# EAGLE schematic i2c_stm32 (EAGLE 9.6.2)

## Sheet 1 of 3: STM32F103C8 - Microcontroller
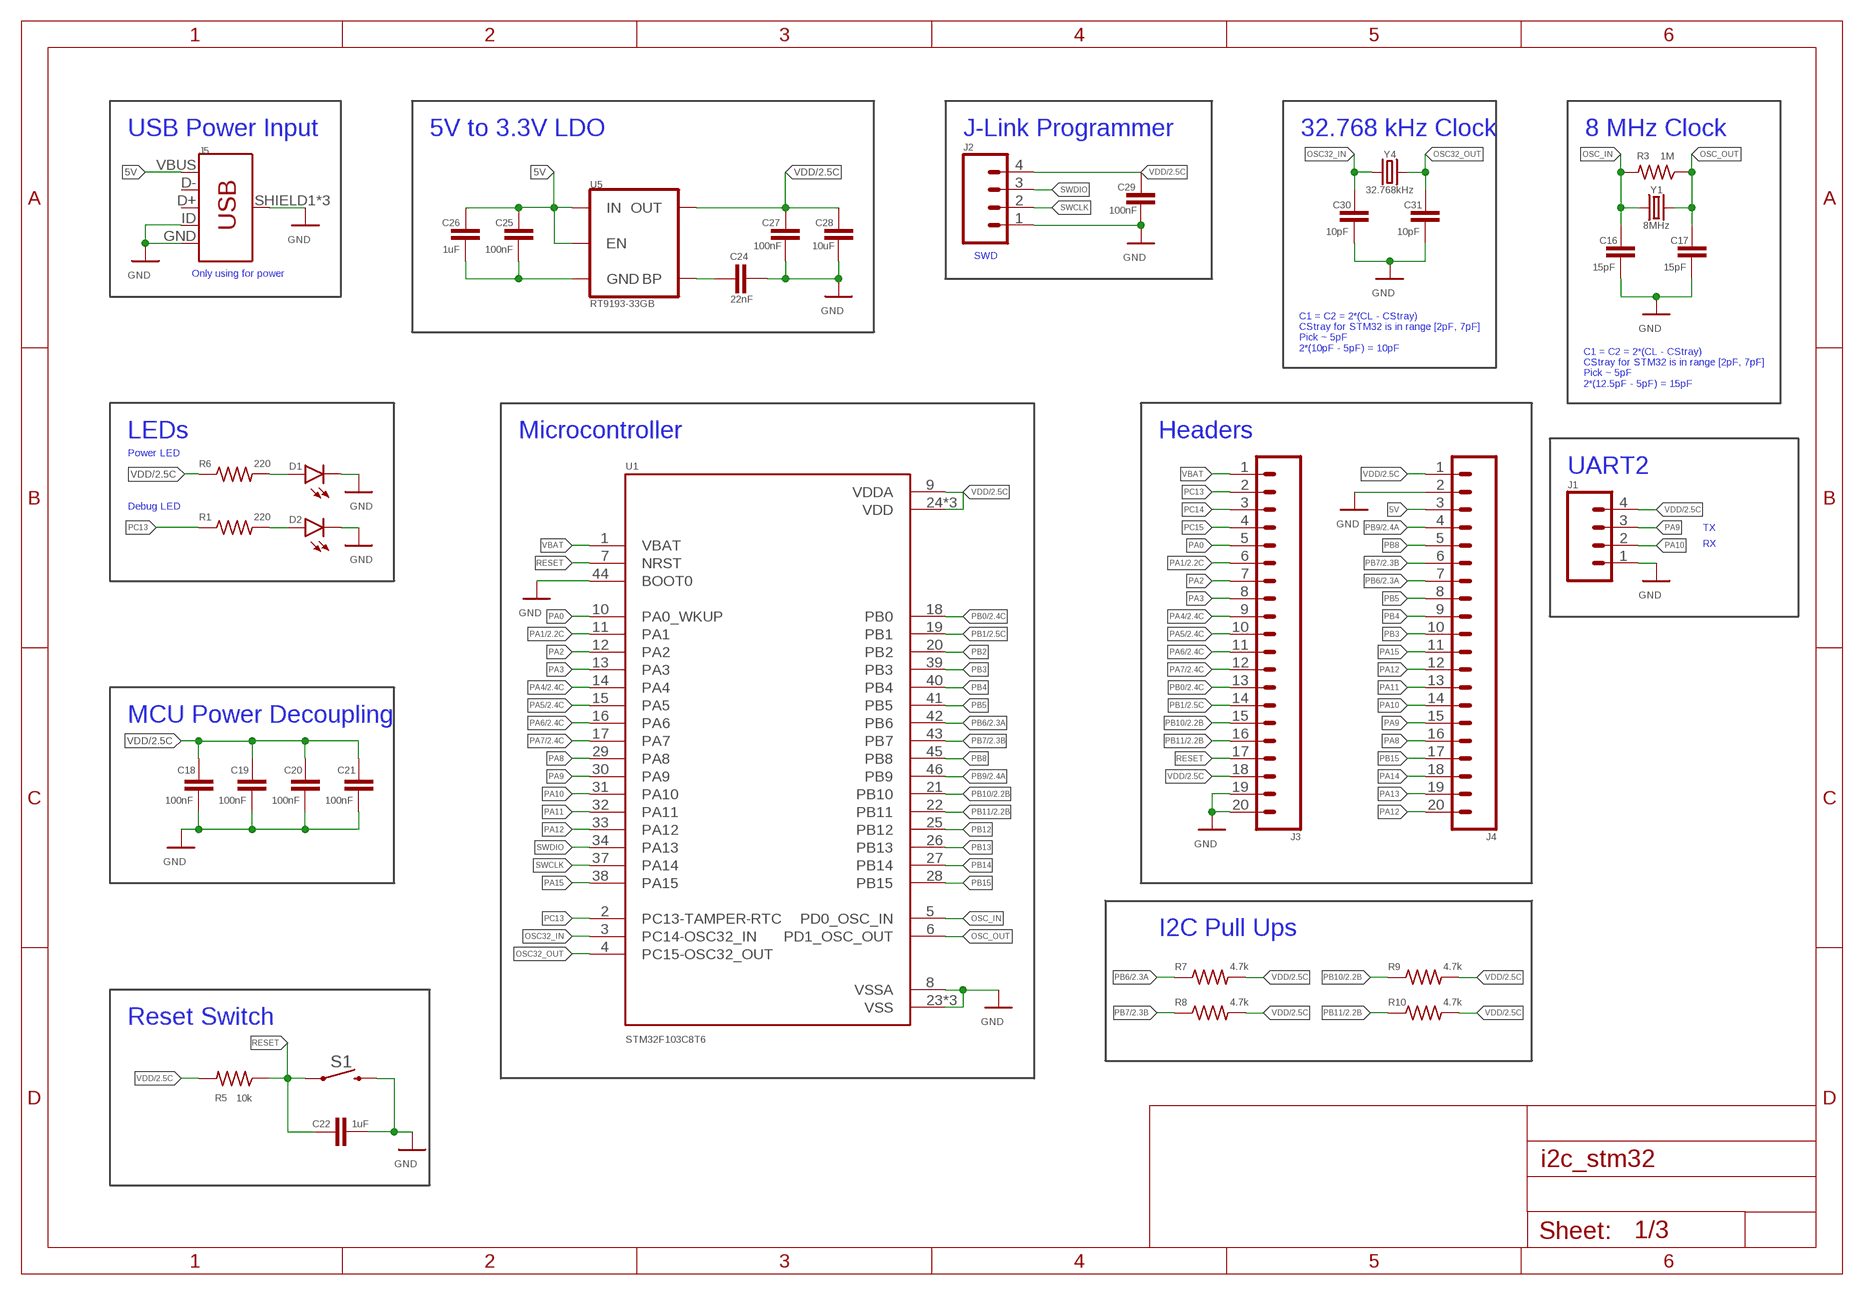
[diagram p0: schematic, sheet 1]

### Parts
C16  15pF  C0603C100C5GACTU  [CAP_0603]
C17  15pF  C0603C100C5GACTU  [CAP_0603]
C18  100nF  C0603C100C5GACTU  [CAP_0603]
C19  100nF  C0603C100C5GACTU  [CAP_0603]
C20  100nF  C0603C100C5GACTU  [CAP_0603]
C21  100nF  C0603C100C5GACTU  [CAP_0603]
C22  1uF  C0603C100C5GACTU  [CAP_0603]
C24  22nF  C0603C100C5GACTU  [CAP_0603]
C25  100nF  C0603C100C5GACTU  [CAP_0603]
C26  1uF  C0603C100C5GACTU  [CAP_0603]
C27  100nF  C0603C100C5GACTU  [CAP_0603]
C28  10uF  C0603C100C5GACTU  [CAP_0603]
C29  100nF  C0603C100C5GACTU  [CAP_0603]
C30  10pF  C0603C100C5GACTU  [CAP_0603]
C31  10pF  C0603C100C5GACTU  [CAP_0603]
D1  LED0603  [LED-0603]
D2  LED0603  [LED-0603]
J1  CONN_04  [1X04]
J2  CONN_04  [1X04]
J3  CONN_20  [1X20]
J4  CONN_20  [1X20]
J5  USB_MICRO-B_FEMALE-SMT  [USB-B-MICRO-SMD]
R1  220  RC0603JR-070RL  [RES_0603]
R3  1M  RC0603JR-070RL  [RES_0603]
R5  10k  RC0603JR-070RL  [RES_0603]
R6  220  RC0603JR-070RL  [RES_0603]
R7  4.7k  RC0603JR-070RL  [RES_0603]
R8  4.7k  RC0603JR-070RL  [RES_0603]
R9  4.7k  RC0603JR-070RL  [RES_0603]
R10  4.7k  RC0603JR-070RL  [RES_0603]
S1  MOMENTARY-SWITCH-SPST-PTH-6.0MM  [TACTILE_SWITCH_PTH_6.0MM]
U1  STM32F103C8T6  [QFP50P900X900X160-48N]
U5  RT9193-33GB  V_REG_MIC5205ADJ  [SOT23-5]
Y1  8MHz  CRYSTAL-8MHZSMD-5X3.2  [CRYSTAL-SMD-5X3.2-4PAD]
Y4  32.768kHz  CRYSTAL-32.768KHZSMD-3.2X1.5  [CRYSTAL-SMD-3.2X1.5MM]

### Nets
5V: C25.2 C26.2 J4.3 J5.VBUS U5.1(IN) U5.3(EN)
GND: C16.2 C17.2 C18.2 C19.2 C20.2 C21.2 C22.2 C24.1 C27.2 C28.2 C29.2 C30.2 C31.2 D1.C D2.C J1.1 J2.1 J3.19 J3.20 J4.2 J5.GND J5.ID J5.SHIELD1(SHIELD) J5.SHIELD2(SHIELD) J5.SHIELD3(SHIELD) S1.3 U1.8(VSSA) U1.23(VSS) U1.35(VSS) U1.44(BOOT0) U1.47(VSS) ; also sheet 2
N$4: D1.A R6.2
N$5: C24.2 U5.4(BP)
N$6: D2.A R1.2
N$14: C25.1 C26.1 U5.2(GND)
OSC32_IN: C30.1 U1.3(PC14-OSC32_IN) Y4.P$1
OSC32_OUT: C31.1 U1.4(PC15-OSC32_OUT) Y4.P$2
OSC_IN: C16.1 R3.2 U1.5(PD0_OSC_IN) Y1.1
OSC_OUT: C17.1 R3.1 U1.6(PD1_OSC_OUT) Y1.3
PA0: J3.5 U1.10(PA0_WKUP)
PA1: J3.6 U1.11(PA1) ; also sheet 2
PA2: J3.7 U1.12(PA2)
PA3: J3.8 U1.13(PA3)
PA4: J3.9 U1.14(PA4) ; also sheet 2
PA5: J3.10 U1.15(PA5) ; also sheet 2
PA6: J3.11 U1.16(PA6) ; also sheet 2
PA7: J3.12 U1.17(PA7) ; also sheet 2
PA8: J4.16 U1.29(PA8)
PA9: J1.3 J4.15 U1.30(PA9)
PA10: J1.2 J4.14 U1.31(PA10)
PA11: J4.13 U1.32(PA11)
PA12: J4.12 J4.20 U1.33(PA12)
PA13: J4.19
PA14: J4.18
PA15: J4.11 U1.38(PA15)
PB0: J3.13 U1.18(PB0) ; also sheet 2
PB1: J3.14 U1.19(PB1) ; also sheet 2
PB2: U1.20(PB2)
PB3: J4.10 U1.39(PB3)
PB4: J4.9 U1.40(PB4)
PB5: J4.8 U1.41(PB5)
PB6: J4.7 R7.1 U1.42(PB6) ; also sheet 2
PB7: J4.6 R8.1 U1.43(PB7) ; also sheet 2
PB8: J4.5 U1.45(PB8)
PB9: J4.4 U1.46(PB9) ; also sheet 2
PB10: J3.15 R9.1 U1.21(PB10) ; also sheet 2
PB11: J3.16 R10.1 U1.22(PB11) ; also sheet 2
PB12: U1.25(PB12)
PB13: U1.26(PB13)
PB14: U1.27(PB14)
PB15: J4.17 U1.28(PB15)
PC13: J3.2 R1.1 U1.2(PC13-TAMPER-RTC)
PC14: J3.3
PC15: J3.4
RESET: C22.1 J3.17 R5.1 S1.1 U1.7(NRST)
SWCLK: J2.2 U1.37(PA14)
SWDIO: J2.3 U1.34(PA13)
VBAT: J3.1 U1.1(VBAT)
VDD: C18.1 C19.1 C20.1 C21.1 C27.1 C28.1 C29.1 J1.4 J2.4 J3.18 J4.1 R5.2 R6.1 R7.2 R8.2 R9.2 R10.2 U1.9(VDDA) U1.24(VDD) U1.36(VDD) U1.48(VDD) U5.5(OUT) ; also sheet 2
Unconnected: J5.D+ J5.D-

### Notes on the sheet
- USB Power Input | 5V to 3.3V LDO | J-Link Programmer | 32.768 kHz Clock | 8 MHz Clock
- SWD
- Only using for power
- C1 = C2 = 2*(CL - CStray)
  CStray for STM32 is in range [2pF, 7pF]
  Pick ~ 5pF
  2*(10pF - 5pF) = 10pF
- C1 = C2 = 2*(CL - CStray)
  CStray for STM32 is in range [2pF, 7pF]
  Pick ~ 5pF
  2*(12.5pF - 5pF) = 15pF
- LEDs | Microcontroller | Headers
- Power LED
- UART2
- Debug LED
- TX
- RX
- MCU Power Decoupling
- I2C Pull Ups
- Reset Switch

## Sheet 2 of 3: BMP280 - Barometer
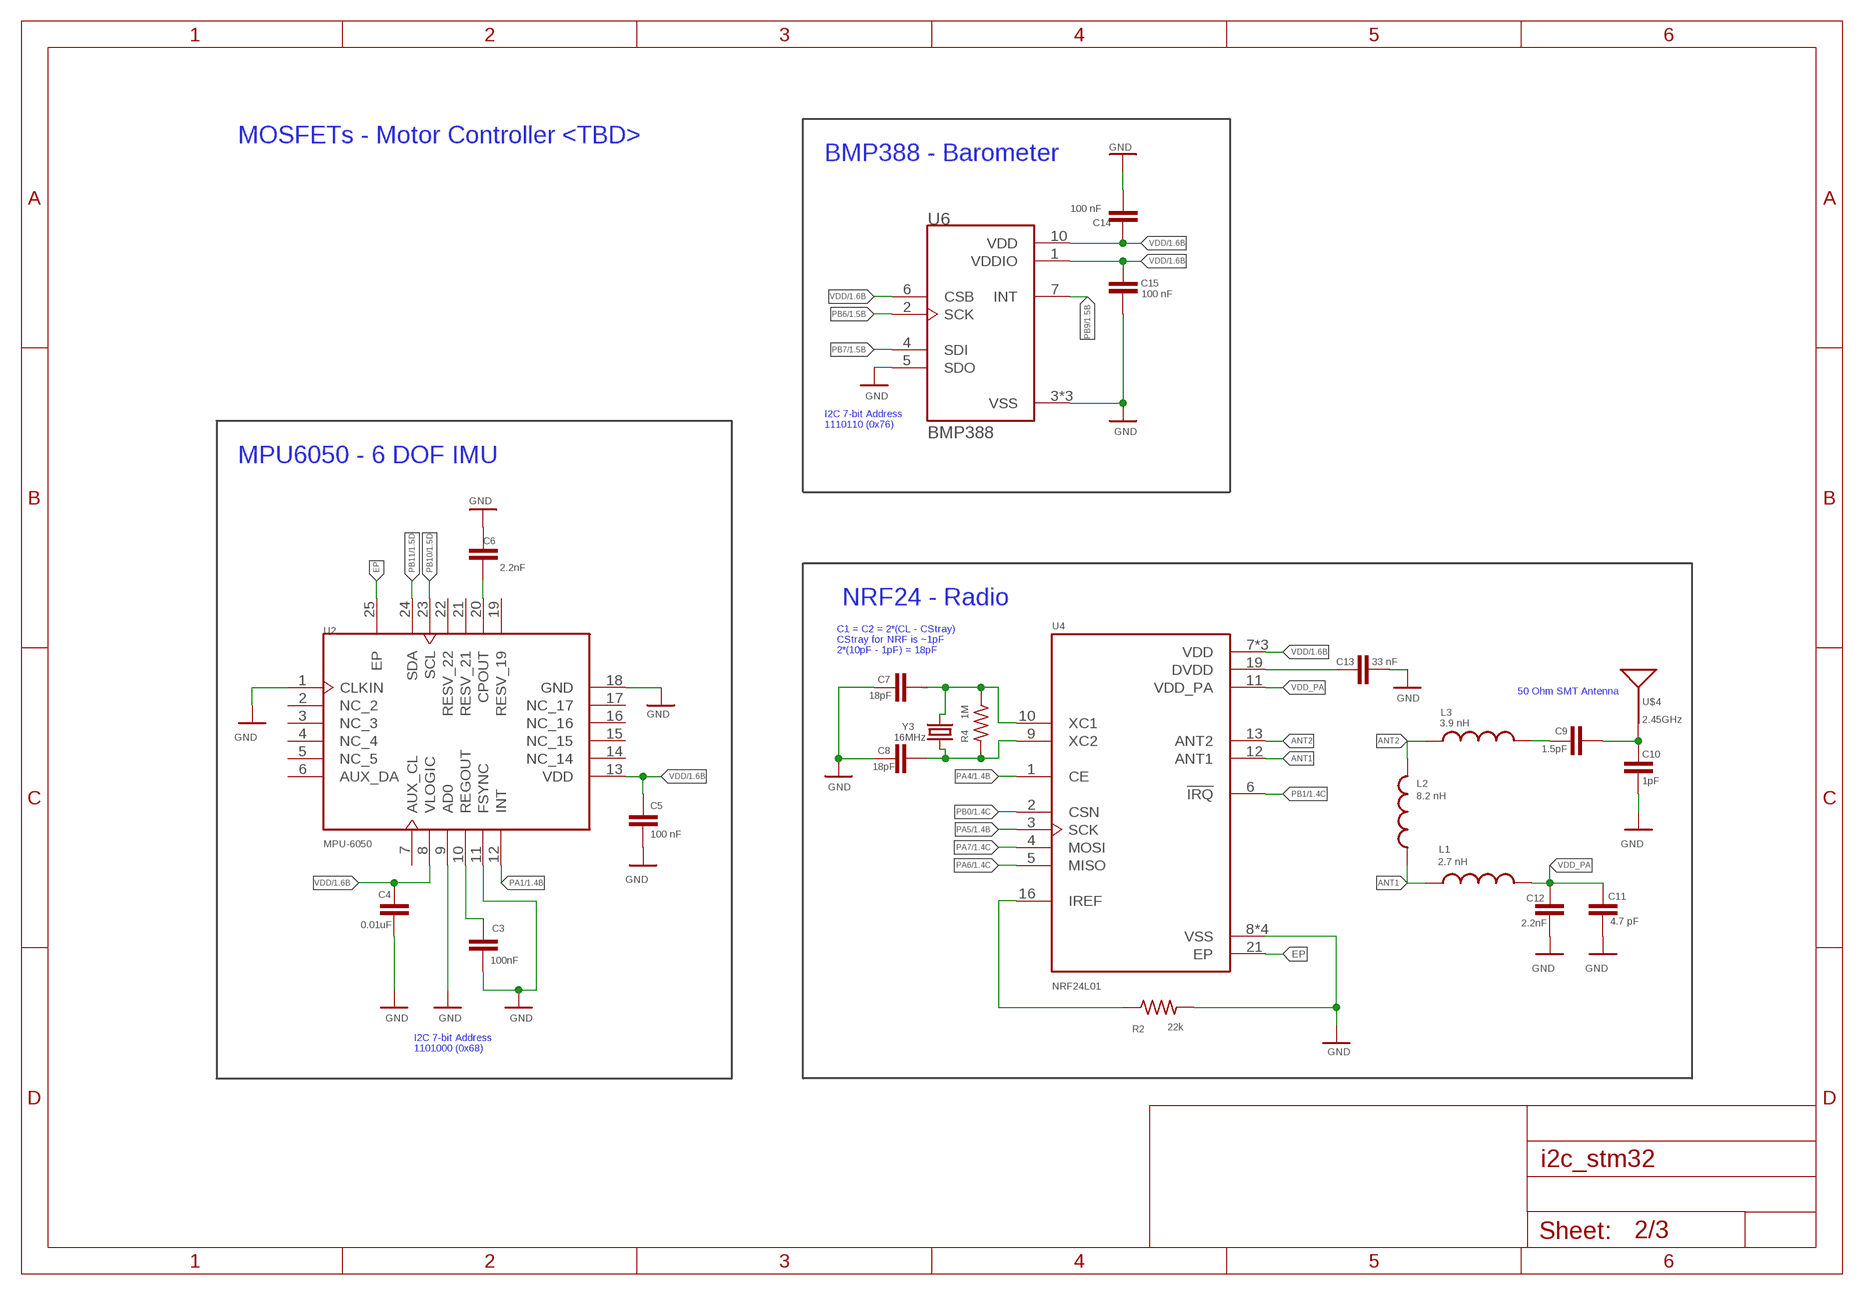
[diagram p1: schematic, sheet 2]

### Parts
C3  100nF  C0603C100C5GACTU  [CAP_0603]
C4  0.01uF  C0603C100C5GACTU  [CAP_0603]
C5  100 nF  C0603C100C5GACTU  [CAP_0603]
C6  2.2nF  C0603C100C5GACTU  [CAP_0603]
C7  18pF  C0603C100C5GACTU  [CAP_0603]
C8  18pF  C0603C100C5GACTU  [CAP_0603]
C9  1.5pF  C0603C100C5GACTU  [CAP_0603]
C10  1pF  C0603C100C5GACTU  [CAP_0603]
C11  4.7 pF  C0603C100C5GACTU  [CAP_0603]
C12  2.2nF  C0603C100C5GACTU  [CAP_0603]
C13  33 nF  C0603C100C5GACTU  [CAP_0603]
C14  100 nF  C0603C100C5GACTU  [CAP_0603]
C15  100 nF  C0603C100C5GACTU  [CAP_0603]
L1  2.7 nH  INDUCTOR_0603_M  [RESC0603_M]
L2  8.2 nH  INDUCTOR_0603_M  [RESC0603_M]
L3  3.9 nH  INDUCTOR_0603_M  [RESC0603_M]
R2  22k  RC0603JR-070RL  [RES_0603]
R4  1M  RC0603JR-070RL  [RES_0603]
U2  MPU-6050  [24-VFQFN]
U4  NRF24L01  [QFN50P400X400X95-21N]
U6  BMP388  [PQFN50P200X200X80-10N]
U$4  2.45GHz  ANTENNA2.4GHZ-6.5X2.2MM  [ANT-2.4GHZ-6.5X2.2MM]
Y3  16MHz  CRYSTAL-16MHZSMD-5X3.2  [CRYSTAL-SMD-5X3.2-4PAD]

### Nets
ANT1: L1.1 L2.1 U4.12(ANT1)
ANT2: L2.2 L3.1 U4.13(ANT2)
EP: U2.25(EP) U4.21(EP)
GND: C3.2 C4.2 C5.2 C6.2 C7.2 C8.2 C10.1 C11.1 C12.1 C13.2 C14.2 C15.1 R2.2 U2.1(CLKIN) U2.9(AD0) U2.11(FSYNC) U2.18(GND) U4.8(VSS) U4.14(VSS) U4.17(VSS) U4.20(VSS) U6.3(VSS) U6.5(SDO) U6.8(VSS) U6.9(VSS) ; also sheet 1
N$2: C3.1 U2.10(REGOUT)
N$3: C6.1 U2.20(CPOUT)
N$7: C8.1 R4.2 U4.9(XC2) Y3.1
N$8: C7.1 R4.1 U4.10(XC1) Y3.3
N$9: R2.1 U4.16(IREF)
N$12: C9.2 C10.2 U$4.FEED(SIGNAL)
N$13: C9.1 L3.2
N$17: C13.1 U4.19(DVDD)
PA1: U2.12(INT) ; also sheet 1
PA4: U4.1(CE) ; also sheet 1
PA5: U4.3(SCK) ; also sheet 1
PA6: U4.5(MISO) ; also sheet 1
PA7: U4.4(MOSI) ; also sheet 1
PB0: U4.2(CSN) ; also sheet 1
PB1: U4.6(!IRQ) ; also sheet 1
PB6: U6.2(SCK) ; also sheet 1
PB7: U6.4(SDI) ; also sheet 1
PB9: U6.7(INT) ; also sheet 1
PB10: U2.23(SCL) ; also sheet 1
PB11: U2.24(SDA) ; also sheet 1
VDD: C4.1 C5.1 C14.1 C15.2 U2.8(VLOGIC) U2.13(VDD) U4.7(VDD) U4.15(VDD) U4.18(VDD) U6.1(VDDIO) U6.6(CSB) U6.10(VDD) ; also sheet 1
VDD_PA: C11.2 C12.2 L1.2 U4.11(VDD_PA)
Unconnected: U2.2(NC_2) U2.3(NC_3) U2.4(NC_4) U2.5(NC_5) U2.6(AUX_DA) U2.7(AUX_CL) U2.14(NC_14) U2.15(NC_15) U2.16(NC_16) U2.17(NC_17) U2.19(RESV_19) U2.21(RESV_21) U2.22(RESV_22)

### Notes on the sheet
- MOSFETs - Motor Controller <TBD>
- BMP388 - Barometer
- I2C 7-bit Address
  1110110 (0x76)
- MPU6050 - 6 DOF IMU
- NRF24 - Radio
- C1 = C2 = 2*(CL - CStray)
  CStray for NRF is ~1pF
  2*(10pF - 1pF) = 18pF
- 50 Ohm SMT Antenna
- I2C 7-bit Address
  1101000 (0x68)

## Sheet 3 of 3
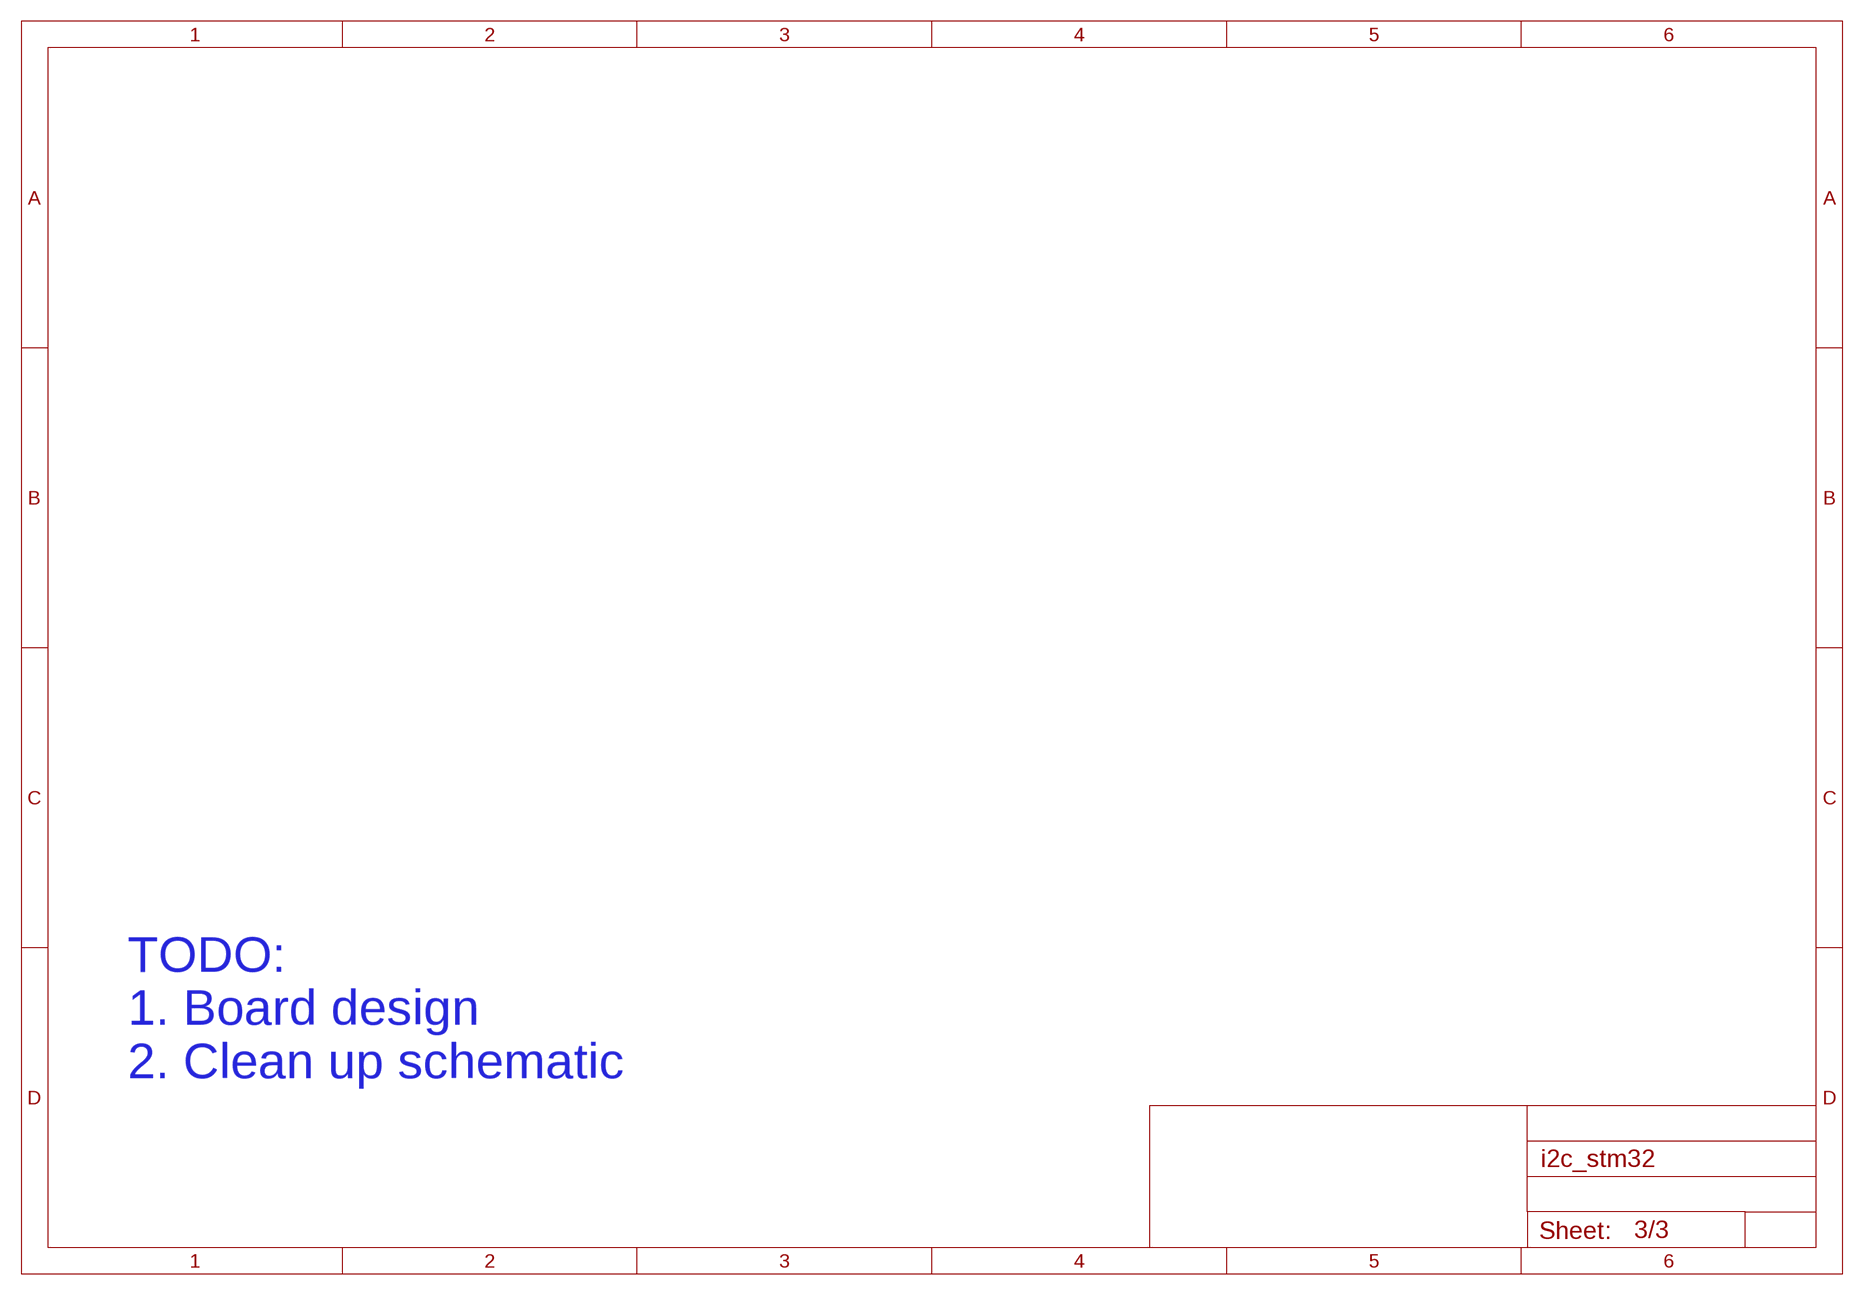
[diagram p2: schematic, sheet 3]

### Notes on the sheet
- TODO:
  1. Board design
  2. Clean up schematic

## Library data of the parts
C3-C22 C24-C31 = Resistor_Capacitor:C0603C100C5GACTU: CAP CER 10PF 50V C0G/NP0 0603 Manufacturer's datasheet <https://content.kemet.com/datasheets/KEM_C1003_C0G_SMD.pdf>; CREATED_BY: PCBLayout.com; DIGIKEY_PART_NUMBER: 399-7814-2-ND; MANUFACTURER: KEMET; MPN: C0603C100C5GACTU; PACKAGE: SMD 0603
D1 D2 = SparkFun-LED:LED: LED (Generic) Standard schematic elements and footprints for 5mm, 3mm, 1206, and 0603 sized LEDs. Generic LEDs with no color specified.
J1 J2 = SparkFun-Connectors:CONN_04: Multi connection point. Often used as Generic Header-pin footprint for 0.1 inch spaced/style header connections On any of the 0.1 inch spaced packages, you can populate with these: Break Away Headers - Straight <https://www.sparkfun.com/products/116> (PRT-00116) Break Away Male Headers - Right Angle <https://www.sparkfun.com/products/553> (PRT-00553) Female Headers <https://www.sparkfun.com/products/115> (PRT-00115) Break Away Headers - Machine Pin <https://www.sparkfun.com/products/117> (PRT-00117) Break Away Female Headers - Swiss Machine Pin <https://www.sparkfun.com/products/743> (PRT-00743) For SCREWTERMINALS and SPRING TERMINALS visit here: Screw Terimnals on SparkFun.com <https://www.sparkfun.com/search/results?term=Screw+Terminals> (5mm/3.5mm/2.54mm spacing) This device is also useful as a general connection point to wire up your design to another part of your project. Our various solder wires solder well into these plated through hole pads. Hook-Up Wire - Assortment (Stranded, 22 AWG) <https://www.sparkfun.com/products/11375> (PRT-11375) Hook-Up Wire - Assortment (Solid Core, 22 AWG) <https://www.sparkfun.com/products/11367> (PRT-11367) View the entire wire category on our website here <https://www.sparkfun.com/categories/141> Special notes: Molex polarized connector foot print use with SKU : PRT-08231 with associated crimp pins and housings. 1MM SMD Version SKU: PRT-10208; PROD_ID: CONN-09696
J3 J4 = SparkFun-Connectors:CONN_20: Multi connection point. Often used as Generic Header-pin footprint for 0.1 inch spaced/style header connections On any of the 0.1 inch spaced packages, you can populate with these: Break Away Headers - Straight <https://www.sparkfun.com/products/116> (PRT-00116) Break Away Male Headers - Right Angle <https://www.sparkfun.com/products/553> (PRT-00553) Female Headers <https://www.sparkfun.com/products/115> (PRT-00115) Break Away Headers - Machine Pin <https://www.sparkfun.com/products/117> (PRT-00117) Break Away Female Headers - Swiss Machine Pin <https://www.sparkfun.com/products/743> (PRT-00743) For SCREWTERMINALS and SPRING TERMINALS visit here: Screw Terimnals on SparkFun.com <https://www.sparkfun.com/search/results?term=Screw+Terminals> (5mm/3.5mm/2.54mm spacing) This device is also useful as a general connection point to wire up your design to another part of your project. Our various solder wires solder well into these plated through hole pads. Hook-Up Wire - Assortment (Stranded, 22 AWG) <https://www.sparkfun.com/products/11375> (PRT-11375) Hook-Up Wire - Assortment (Solid Core, 22 AWG) <https://www.sparkfun.com/products/11367> (PRT-11367) View the entire wire category on our website here <https://www.sparkfun.com/categories/141> Special notes: Molex polarized connector foot print use with SKU : PRT-08231 with associated crimp pins and housings. 1MM SMD Version SKU: PRT-10208 NOTES ON THE VARIANTS LOCK and LOCK_LONGPADS... This footprint was designed to help hold the alignment of a through-hole component (i.e. 6-pin header) while soldering it into place. You may notice that each hole has been shifted either up or down by 0.005 of an inch from it's more standard position (which is a perfectly straight line). This slight alteration caused the pins (the squares in the middle) to touch the edges of the holes. Because they are alternating, it causes a "brace" to hold the component in place. 0.005 has proven to be the perfect amount of "off-center" position when using our standard breakaway headers. Although looks a little odd when you look at the bare footprint, once you have a header in there, the alteration is very hard to notice. Also,if you push a header all the way into place, it is covered up entirely on the bottom side. Note about LOCK SPECIAL package: This is just like the LOCK variant in that the holes are staggared by 5 mil, but except for the last two holes. They are not altered from the "standard" footprint layout. This is used for a special purpose on the layout of our Graphic LCD Backpack. Make sure you want to use this device before selecting it for you project!
J5 = SparkFun-Connectors:USB_MICRO-B: USB Type Micro-B Connector Male/female and PTH/SMT variants SparkFun Products: SparkFun microB USB Breakout <https://www.sparkfun.com/products/12035> SparkFun USB microB Plug Breakout <https://www.sparkfun.com/products/10031> SparkFun ESP8266 Thing <https://www.sparkfun.com/products/13231>; PROD_ID: CONN-11752
L1-L3 = Nordic_nRF:INDUCTOR: Generic chip inductor
R1-R10 = Resistor_Capacitor:RC0603JR-070RL: RES SMD 0 OHM JUMPER 1/10W 0603 Manufacturer's datasheet <http://www.yageo.com/documents/recent/PYu-RC_Group_51_RoHS_L_10.pdf>; CREATED_BY: PCBLayout.com; DIGIKEY_PART_NUMBER: 311-0.0GRTR-ND; MANUFACTURER: Yageo; MPN: RC0603JR-070RL; PACKAGE: SMD 0603
S1 = SparkFun-Switches:MOMENTARY-SWITCH-SPST: Momentary Switch (Pushbutton) - SPST Normally-open (NO) SPST momentary switches (buttons, pushbuttons). Variants PTH-12MM - 12mm square, through-hole Momentary Pushbutton Switch - 12mm Square <https://www.sparkfun.com/products/9190> (COM-09190) PTH-6.0MM, PTH-6.0MM-KIT - 6.0mm square, through-hole Mini Pushbutton Switch <https://www.sparkfun.com/products/97> (COM-00097) KIT package intended for soldering kit's - only one side of pads' copper is exposed. PTH-RIGHT-ANGLE-KIT - Right-angle, through-hole Right Angle Tactile Button <https://www.sparkfun.com/products/10791> - Used on SparkFun BigTime Watch Kit <https://www.sparkfun.com/products/11734> SMD-12MM - 12mm square, surface-mount Tactile Button - SMD (12mm) <https://www.sparkfun.com/products/12993> (COM-12993) Used on SparkFun PicoBoard <https://www.sparkfun.com/products/11888> SMD-4.5MM - 4.5mm Square Trackball Switch Used on SparkFun Blackberry Trackballer Breakout <https://www.sparkfun.com/products/13169> SMD-4.6MMX2.8MM - 4.60mm x 2.80mm, surface mount Used on SparkFun SAMD21 Mini Breakout <https://www.sparkfun.com/products/13664> SMD-5.2MM, SMD-5.2-REDUNDANT - 5.2mm square, surface-mount Mini Pushbutton Switch - SMD <https://www.sparkfun.com/products/8720> (COM-08720) Used on Arduino Pro Mini <https://www.sparkfun.com/products/11114> REDUNDANT package connects both switch circuits together SMD-6.0X3.5MM - 6.0 x 3.5mm, surface mount Momentary Reset Switch SMD <https://www.sparkfun.com/products/8229> (COM-08229) SMD-6.2MM-TALL - 6.2mm square, surface mount Tactile Button - SMD (6mm) <https://www.sparkfun.com/products/12992> Used on SparkFun Digital Sandbox <https://www.sparkfun.com/products/12651> SMD-RIGHT-ANGLE - Right-angle, surface mount Used on SparkFun Block for Intel® Edison - Arduino <https://www.sparkfun.com/products/13036>; PROD_ID: SWCH-08441; SF_SKU: COM-00097
U1 = STM32F103C8T6:STM32F103C8T6: Mainstream Performance line, ARM Cortex-M3 MCU with 64 Kbytes Flash, 72 MHz CPU, motor control, USB and CAN Check prices <https://pricing.snapeda.com/parts/STM32F103C8T6/STMicroelectronics/view-part?ref=eda>; AVAILABILITY: Warning; DESCRIPTION: ARM® Cortex®-M3 STM32F1 Microcontroller IC 32-Bit 72MHz 64KB (64K x 8) FLASH 48-LQFP (7x7); MF: STMicroelectronics; MP: STM32F103C8T6; PACKAGE: LQFP-48 STMicroelectronics; PRICE: None; PURCHASE-URL: https://pricing.snapeda.com/search/part/STM32F103C8T6/?ref=eda; SPICEPREFIX: X
U2 = Sensor:MPU-6050: IMU ACCEL/GYRO 3-AXIS I2C 24QFN Manufacturer's datasheet <https://store.invensense.com/datasheets/invensense/MPU-6050_DataSheet_V3%204.pdf>; CREATED_BY: PCBLayout.com; DIGIKEY_PART_NUMBER: 1428-1007-1-ND; MANUFACTURER: TDK InvenSense; MPN: MPU-6050; PACKAGE: 24-VFQFN
U4 = NRF24L01:NRF24L01: The nRF24L01 is a single chip 2.4GHz transceiver with an embedded baseband protocol engine (Enhanced ShockBurst™), designed for ultra low power wireless applications. The nRF24L01 is designed for operation in the world wide ISM frequency band at 2.400 - 2.4835GHz. An MCU (microcontroller) and very few external passive components are needed to design a radio system with the nRF24L01. The nRF24L01 is configured and operated through a Serial Peripheral Interface (SPI.) Through this interface the register map is available. The register map contains all configuration registers in the nRF24L01 and is accessible in all operation modes of the chip. Check prices <https://pricing.snapeda.com/parts/NRF24L01/Nordic/view-part?ref=eda>; AVAILABILITY: Warning; DESCRIPTION: IC RF TxRx Only General ISM > 1GHZ 2.4GHz 20-VFQFN Exposed Pad; MF: Nordic; MP: NRF24L01; PACKAGE: VFQFN-20 Nordic Semiconductor; PRICE: None; PURCHASE-URL: https://pricing.snapeda.com/search/part/NRF24L01/?ref=eda
U5 = SparkFun-IC-Power:V_REG_MIC5205: V_REG MIC5205 Standard 3.3V, 5V, and Adjustable 150mA LDO voltage regulator in SOT-23 layout. Micrel part MIC5205. BP (by-pass) pin is used to lower output noise with 470pF cap, may be left open. On the adjustable version BP is used to set output.; PROD_ID: VREG-12594; VALUE: ADJ
U6 = BMP388:BMP388: P-Sensor SPI I2C 1, 25 Bar SMD; DESCRIPTION: Pressure Sensor 4.35PSI ~ 18.13PSI (30kPa ~ 125kPa) Absolute 10-WFLGA; DIGI-KEY_PART_NUMBER: 828-1079-1-ND; MF: Bosch Sensortec; MP: BMP388; PACKAGE: WFLGA-10 Bosch Tools; PURCHASE-URL: https://pricing.snapeda.com/search/part/BMP388/?ref=eda
U$4 = SparkFun-RF:ANTENNA: Single-ended Antennae 2.4GHz and antennae with just one terminal. These are all chip antennae. 2.4GHz (WiFi/BT/ZigBee) Antennae ANT-2.4GHZ-6.5X2.2MM - 6.5 x 2.2 mm chip antenna. (SparkFun Product <https://www.sparkfun.com/products/144>) ANT-2.4GHZ8.0X1.0MM - 8.0 x 1.0 mm chip antenna. (Datasheet <http://www.mouser.com/ds/2/611/antenna_2500at44m0400-242425.pdf>) ANT-2.4GHZ9.5X2.0MM - 9.5 x 2.0 mm chip antenna. (SparkFun Product <https://www.sparkfun.com/products/9025>); PROD_ID: ANT-08187; SF_ID: WRL-00144
Y1 = SparkFun-Clocks:CRYSTAL-8MHZ: 8MHz Crystal Datasheet Example <http://www.futureelectronics.com/en/technologies/electromechanical/timing-devices/crystals/Pages/6008189-ABM3B-8.000MHZ-B2-T.aspx?IM=0> Frequency: 8MHz Frequency Tolerance: ±20ppm Load Capacitance: 18pF SparkFun Products: Pro Micro -3.3V/8MHz <https://www.sparkfun.com/products/12587> WAV Trigger <https://www.sparkfun.com/products/13660>; PROD_ID: XTAL-09431
Y3 = SparkFun-Clocks:CRYSTAL-16MHZ: 16MHz Crystal Digikey Example <http://www.digikey.com/product-search/en?keywords=535-9122-1-ND> Frequency: 16MHz Frequency Stability: ±50ppm Frequency Tolerance: ±20ppm Load Capacitance: 18pF SparkFun Products: Pro Micro -5V/16MHz <https://www.sparkfun.com/products/12640> SparkFun Serial Enabled LCD Kit <https://www.sparkfun.com/products/10097>; PROD_ID: XTAL-08218; SF_ID: COM-00094
Y4 = SparkFun-Clocks:CRYSTAL-32.768KHZ: 32.768kHz Crystal Frequency: 32.768kHz Frequency Stability: ±20ppm Load Capacitance: 12.5pF (PTH-2X6 & SMD-3.2X1.5), 6pF (SMD-2X6) SparkFun Products: SparkFun BigTime Watch Kit <https://www.sparkfun.com/products/11734> SparkFun nRF52832 Breakout <https://www.sparkfun.com/products/13990> SparkFun Real Time Clock Module <https://www.sparkfun.com/products/12708>; PROD_ID: XTAL-13062